# Altium schematic sheet _2__Power_Supply_Board.SchDoc
size A4; DocumentNumber: 2; SheetNumber: 2; SheetTotal: 2
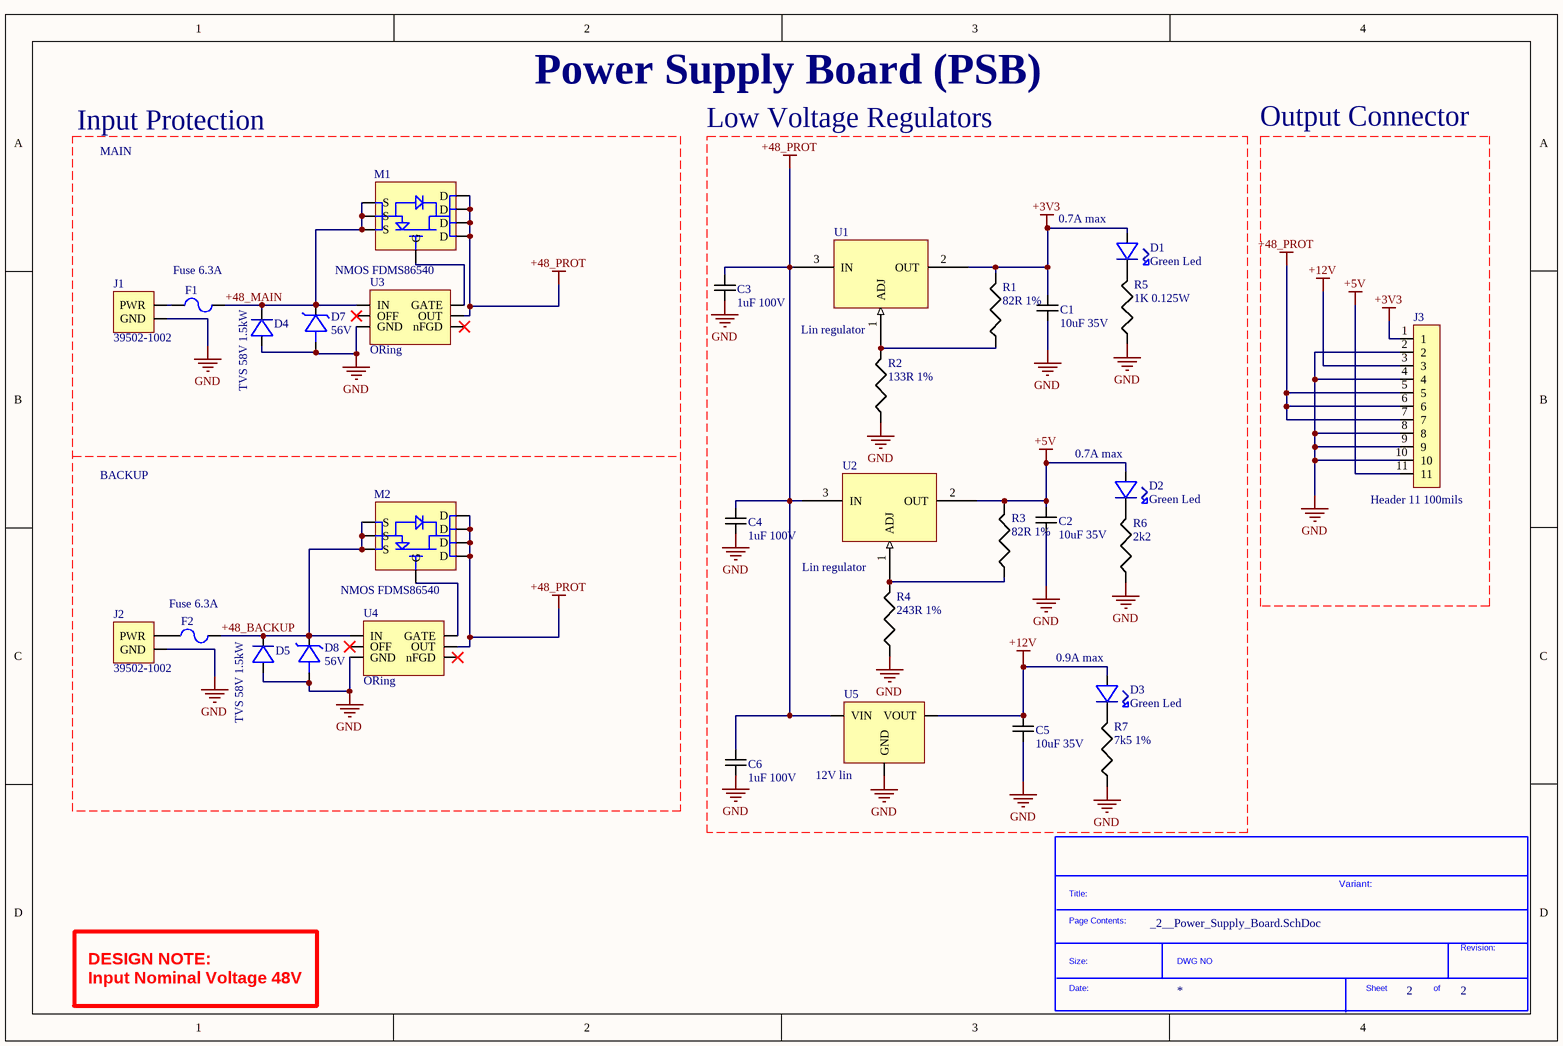
[diagram p0: _2__Power_Supply_Board.SchDoc]

## Parts
*?  SDTitleBlock  (value not drawn)  (graphical)
C1  10uF 35V  [Capacitor 1206]
C2  10uF 35V  [Capacitor 1206]
C3  1uF 100V  [C0805]
C4  1uF 100V  [C0805]
C5  10uF 35V  [Capacitor 1206]
C6  1uF 100V  [C0805]
D1  Green Led  [Led Green 0805  Dialight 5988]
D2  Green Led  [Led Green 0805  Dialight 5988]
D3  Green Led  [Led Green 0805  Dialight 5988]
D4  TVS 58V 1.5kW  [TVS SMCJSeries]
D5  TVS 58V 1.5kW  [TVS SMCJSeries]
D7  56V  [DIODE ZENER 56V 1SMA5943BT3G]
D8  56V  [DIODE ZENER 56V 1SMA5943BT3G]
F1  Fuse 6.3A  [FUSE SMD 6.3A SF-2410FP630W]
F2  Fuse 6.3A  [FUSE SMD 6.3A SF-2410FP630W]
J1  39502-1002  [Terminal Block 0395021002]
J2  39502-1002  [Terminal Block 0395021002]
J3  Header 11 100mils  [Header 11 pos Male 2.54]
M1  NMOS FDMS86540  [NMOS FDMS86540]
M2  NMOS FDMS86540  [NMOS FDMS86540]
R1  82R 1%  [Resistor R0805 Panasonic ERJ]
R2  133R 1%  [Resistor R0805 Panasonic ERJ]
R3  82R 1%  [Resistor R0805 Panasonic ERJ]
R4  243R 1%  [Resistor R0805 Panasonic ERJ]
R5  1K 0.125W  [Resistor R0805 Panasonic ERJ]
R6  2k2  [Resistor R0805 Panasonic ERJ]
R7  7k5 1%  [Resistor R0805 Panasonic ERJ]
U1  Lin regulator  [Linear TL783CKTTR]
U2  Lin regulator  [Linear TL783CKTTR]
U3  ORing  [LM5050]
U4  ORing  [LM5050]
U5  12V lin  [Linear ZXTR2012K]

## Nets
+3V3: C1.2 D1.2 J3.1 R1.2 U1.2(OUT)
+5V: C2.2 D2.2 J3.11 R3.2 U2.2(OUT)
+12V: C5.2 D3.2 J3.3 U5.3(VOUT)
+48_PROT: C3.2 C4.2 C6.2 J3.5 J3.6 J3.7 M1.5(D) M1.6(D) M1.7(D) M1.8(D) M2.5(D) M2.6(D) M2.7(D) M2.8(D) U1.3(IN) U2.3(IN) U3.6(OUT) U4.6(OUT) U5.2(VIN)
GND: C1.1 C2.1 C3.1 C4.1 C5.1 C6.1 D4.2 D5.2 D7.2 D8.2 J1.2(GND) J2.2(GND) J3.2 J3.4 J3.8 J3.9 J3.10 R2.1 R4.1 R5.1 R6.1 R7.1 U3.2(GND) U4.2(GND) U5.1(GND)
+48_BACKUP: D5.1 D8.1 F2.2 M2.1(S) M2.2(S) M2.3(S) U4.4(IN)
+48_MAIN: D4.1 D7.1 F1.2 M1.1(S) M1.2(S) M1.3(S) U3.4(IN)
NetD1_1: D1.1 R5.2
NetD2_1: D2.1 R6.2
NetD3_1: D3.1 R7.2
NetF1_1: F1.1 J1.1(PWR)
NetF2_1: F2.1 J2.1(PWR)
NetM1_4: M1.4(G) U3.5(GATE)
NetM2_4: M2.4(G) U4.5(GATE)
NetR1_1: R1.1 R2.2 U1.1(ADJ)
NetR3_1: R3.1 R4.2 U2.1(ADJ)

Not connected (* = marked no-connect by the designer): U3 1(nFGD)* 3(OFF)*; U4 1(nFGD)* 3(OFF)*

## Notes on the sheet
- Power Supply Board (PSB)
- Input Protection
- MAIN
- Low Voltage Regulators
- Output Connector
- (near D1) 0.7A max
- (near D2) 0.7A max
- BACKUP
- (near D3) 0.9A max
- Variant:
- DESIGN NOTE:
  Input Nominal Voltage 48V
- Title
- Size:
- Date:
- A4
- Number:
- Time:
- Revision:
- Sheet
- of
- File:
- (in symbol SDTitleBlock) Title:; Page Contents:; Revision:; Size:; DWG NO; Date:; Sheet; of

## Library data of the parts
C1 C2 C5 = GMK316AB7106KL-TR: CAP CER 10UF 35V X7R 1206; Manufacturer: Taiyo Yuden; Tolerance: 10%; Supplier 1: Digi-Key; Manufacturer Part Number: GMK316AB7106KL-TR; Stock 1: 2000; Pricing 1: 1=0.61, 10=0.431, 100=0.2841, 500=0.21046, 1000=0.17888 (USD); Mount: Surface Mount; Case/Package: 1206; Case Code (Imperial): 1206; Case Code (Metric): 3216; Min Operating Temperature: -55°C; Max Operating Temperature: 125°C; Capacitance: 10uF; Package Quantity: 2000; Voltage Rating: 35V; Voltage Rating (DC): 35V; Packaging: Tape and Reel; Dielectric: X7R; Termination: SMD/SMT; Composition: Ceramic; Length: 0.126inch; Height: 1.6mm; Width: 1.6mm; Thickness: 0.071inch; REACH SVHC: No SVHC; ComponentLink1URL: http://www.farnell.com/datasheets/1497285.pdf; ComponentLink1Description: http://www.farnell.com/datasheets/1497285.pdf; ComponentLink2URL: https://media.digikey.com/pdf/Data%20Sheets/Taiyo%20Yuden%20PDFs%20URL%20links/GMK316AB7106KL-TR_ProdSpec.pdf; ComponentLink2Description: https://media.digikey.com/pdf/Data%20Sheets/Taiyo%20Yuden%20PDFs%20URL%20links/GMK316AB7106KL-TR_ProdSpec.pdf; Supplier Part Number 1: 587-3007-6-ND
C3 C4 C6 = GRM21BC72A105KE01L: Cap Ceramic 1uF 100V X7S 10% Pad SMD 0805 125C T/R; Manufacturer: Murata; Supplier 1: Digi-Key; Manufacturer Part Number: GRM21BC72A105KE01L; RoHS: No; Category: Ceramic Capacitors; Stock 1: 18361; Pricing 1: 1=0,46000, 10=0,32600, 100=0,21450, 500=0,15888, 1000=0,13505 (USD); Voltage Rating (DC): 100V; Dielectric: X7S; Tolerance: 10%; Capacitance: 1uF; Length: 2mm; Width: 1.25mm; Thickness: 1.25mm; ComponentLink1URL: http://search.murata.co.jp/Ceramy/image/img/A01X/G101/ENG/GRM21BC72A105KE01-01.pdf?src-supplier=Digi-Key; ComponentLink1Description: http://search.murata.co.jp/Ceramy/image/img/A01X/G101/ENG/GRM21BC72A105KE01-01.pdf?src-supplier=Digi-Key; ComponentLink2URL: https://search.murata.co.jp/Ceramy/image/img/A01X/G101/ENG/GRM21BC72A105KE01-01.pdf?src-supplier=Digi-Key; ComponentLink2Description: https://search.murata.co.jp/Ceramy/image/img/A01X/G101/ENG/GRM21BC72A105KE01-01.pdf?src-supplier=Digi-Key; Supplier Part Number 1: 490-14464-1-ND
D1-D3 = 598-8170-107F: LED 0805 GREEN 20MCD; Manufacturer: Dialight; Lens Color: Colorless,Clear; Lens Transparency: Clear; Reverse Voltage: 5V; Lens Style: Flat,Rectangular,Clear,Diffused,Colorless; Forward Voltage: 2.4V; Viewing Angle: 140°; Wavelength: 570nm; Forward Current: 20mA; Number of LEDs: 1; Power Dissipation: 60mW; Lens Size: 1.25mm; Supplier 1: Digi-Key; Manufacturer Part Number: 598-8170-107F; RoHS: Yes; Category: LEDs; Stock 1: 101069; Pricing 1: 1=0,39000, 10=0,28200, 100=0,12520, 500=0,08766, 1000=0,07201 (USD); Mount: Surface Mount; Case/Package: 0805; Number of Pins: 2; Case Code (Imperial): 0805; Case Code (Metric): 2012; Color: Green; Min Operating Temperature: -30°C; Max Operating Temperature: 85°C; Package Quantity: 3000; Packaging: Tape and Reel; Luminous Intensity: 20mcd; Illumination Color: Green; Test Current: 20mA; Dominant Wavelength: 570nm; Number of Elements: 1; Length: 2mm; Height: 0.8mm; Width: 1.25mm; Depth: 1.25mm; Radiation Hardening: No; REACH SVHC: No SVHC; Lead Free: Lead Free; ComponentLink1URL: https://datasheet.ciiva.com/11774/0900766b80ae2984-11774107.pdf?src-supplier=RSComponents; ComponentLink1Description: https://datasheet.ciiva.com/11774/0900766b80ae2984-11774107.pdf?src-supplier=RSComponents; ComponentLink2URL: https://datasheet.ciiva.com/15117/getdatasheetpartid-104614-15117453.pdf?src-supplier=Verical; ComponentLink2Description: https://datasheet.ciiva.com/15117/getdatasheetpartid-104614-15117453.pdf?src-supplier=Verical; ComponentLink3URL: https://datasheet.ciiva.com/2110/smt-selector-guide-2110053.pdf?src-supplier=Digi-Key; ComponentLink3Description: https://datasheet.ciiva.com/2110/smt-selector-guide-2110053.pdf?src-supplier=Digi-Key; ComponentLink4URL: https://datasheet.ciiva.com/1243/25662-1243901.pdf?src-supplier=Element14; ComponentLink4Description: https://datasheet.ciiva.com/1243/25662-1243901.pdf?src-supplier=Element14; ComponentLink5URL: https://datasheet.ciiva.com/30132/mdei5980805-a-w-30132781.pdf?src-supplier=Onlinecomponents.com; ComponentLink5Description: https://datasheet.ciiva.com/30132/mdei5980805-a-w-30132781.pdf?src-supplier=Onlinecomponents.com; ComponentLink6URL: https://datasheet.ciiva.com/2110/smt-selector-guide-2110051.pdf?src-supplier=Digi-Key; ComponentLink6Description: https://datasheet.ciiva.com/2110/smt-selector-guide-2110051.pdf?src-supplier=Digi-Key; ComponentLink7URL: https://datasheet.ciiva.com/2110/smt-selector-guide-2110052.pdf?src-supplier=Digi-Key; ComponentLink7Description: https://datasheet.ciiva.com/2110/smt-selector-guide-2110052.pdf?src-supplier=Digi-Key; ComponentLink8URL: https://datasheet.ciiva.com/15965/mdei5980805-a-w-15965496.pdf?src-supplier=Onlinecomponents.com; ComponentLink8Description: https://datasheet.ciiva.com/15965/mdei5980805-a-w-15965496.pdf?src-supplier=Onlinecomponents.com; ComponentLink9URL: https://datasheet.ciiva.com/22748/1484480-22748121.pdf?src-supplier=Element14; ComponentLink9Description: https://datasheet.ciiva.com/22748/1484480-22748121.pdf?src-supplier=Element14; ComponentLink10URL: https://datasheet.ciiva.com/1243/25662-1243902.pdf?src-supplier=Element14; ComponentLink10Description: https://datasheet.ciiva.com/1243/25662-1243902.pdf?src-supplier=Element14; Supplier Part Number 1: 350-2044-1-ND
D4 D5 = SMCJ58CA: TVS DIODE 58VWM 93.6VC SMC; Manufacturer: Littelfuse; Leakage Current: 1uA; Breakdown Voltage: 64.4V; Number of Channels: 1; Clamping Voltage: 93.6V; Polarity: Bidirectional; Power Line Protection: No; Peak Pulse Current: 16.1A; Test Current: 1mA; Max Breakdown Voltage: 71.2V; Max Power Dissipation: 6.5W; Supplier 1: Digi-Key; Manufacturer Part Number: SMCJ58CA; RoHS: Yes; Category: TVS Diodes; Stock 1: 5077; Pricing 1: 1=0,61000, 10=0,52500, 25=0,49000, 100=0,36400, 250=0,34580, 500=0,28420, 1000=0,23100 (USD); Mount: Surface Mount; Number of Pins: 2; Min Operating Temperature: -65°C; Max Operating Temperature: 150°C; Voltage Rating (DC): 58V; Peak Pulse Power: 1.5kW; Termination: SMD/SMT; Number of Bidirectional Channels: 1; Direction: Bidirectional; Reverse Standoff Voltage: 58V; Min Breakdown Voltage: 64.4V; Reverse Breakdown Voltage: 64.4V; Packaging: Tape and Reel; Number of Elements: 1; Package Quantity: 3000; Operating Supply Voltage: 58V; Power Dissipation: 1.5kW; Max Surge Current: 16.1A; Composition: Zener; Length: 8.13mm; Height: 2.62mm; Width: 6.22mm; Lead Free: Lead Free; REACH SVHC: No SVHC; ComponentLink1URL: https://datasheet.ciiva.com/16388/smcj58ca-16388266.pdf?src-supplier=Future+Electronics; ComponentLink1Description: https://datasheet.ciiva.com/16388/smcj58ca-16388266.pdf?src-supplier=Future+Electronics; ComponentLink2URL: https://datasheet.ciiva.com/4509/littelfuse-tvs-diode-smcj-62645-4509016.pdf?src-supplier=Mouser; ComponentLink2Description: https://datasheet.ciiva.com/4509/littelfuse-tvs-diode-smcj-62645-4509016.pdf?src-supplier=Mouser; ComponentLink3URL: https://datasheet.ciiva.com/332/littelfuse-tvs-diode-smcj-datasheet-pdf-332399.pdf?src-supplier=Digi-Key; ComponentLink3Description: https://datasheet.ciiva.com/332/littelfuse-tvs-diode-smcj-datasheet-pdf-332399.pdf?src-supplier=Digi-Key; ComponentLink4URL: https://datasheet.ciiva.com/332/littelfuse-tvs-diode-smcj-datasheet-pdf-332397.pdf?src-supplier=Digi-Key; ComponentLink4Description: https://datasheet.ciiva.com/332/littelfuse-tvs-diode-smcj-datasheet-pdf-332397.pdf?src-supplier=Digi-Key; ComponentLink5URL: https://datasheet.ciiva.com/332/littelfuse-tvs-diode-smcj-datasheet-pdf-332398.pdf?src-supplier=Digi-Key; ComponentLink5Description: https://datasheet.ciiva.com/332/littelfuse-tvs-diode-smcj-datasheet-pdf-332398.pdf?src-supplier=Digi-Key; Supplier Part Number 1: SMCJ58CALFCT-ND
D7 D8 = 1SMA5943BT3G: Diodes Zener 56V 1.5W; Manufacturer: ON Semiconductor; Impedance: 86R; Max Reverse Leakage Current: 500nA; Voltage Tolerance: 5%; Power Dissipation: 500mW; Zener Current: 27mA; Test Current: 6.7mA; Breakdown Voltage: 58.8V; Forward Voltage: 1.5V; Element Configuration: Single; Supplier 1: Digi-Key; Manufacturer Part Number: 1SMA5943BT3G; RoHS: Yes; Category: Zener Diodes; Stock 1: 25856; Pricing 1: 1=0,43000, 10=0,32200, 25=0,29040, 100=0,15310, 250=0,15152, 500=0,13570, 1000=0,10560, 2500=0,09662 (USD); Case/Package: SMA; Number of Pins: 2; Min Operating Temperature: -65°C; Max Operating Temperature: 150°C; Packaging: Tape and Reel; Zener Voltage: 56V; Max Power Dissipation: 1.5W; Power Rating: 1.5W; Voltage Rating (DC): 56V; Tolerance: 5%; Working Voltage: 56V; Package Quantity: 1; Peak Reverse Current: 500nA; Length: 4.57mm; Height: 2.05mm; Width: 2.92mm; Radiation Hardening: No; Lead Free: Lead Free; Halogen Free: Halogen Free; REACH SVHC: No SVHC; ComponentLink1URL: https://datasheet.ciiva.com/15142/getdatasheetpartid-53895-15142138.pdf?src-supplier=Verical; ComponentLink1Description: https://datasheet.ciiva.com/15142/getdatasheetpartid-53895-15142138.pdf?src-supplier=Verical; ComponentLink2URL: https://datasheet.ciiva.com/4733/1sma5913bt3-d-4733669.pdf?src-supplier=Mouser; ComponentLink2Description: https://datasheet.ciiva.com/4733/1sma5913bt3-d-4733669.pdf?src-supplier=Mouser; ComponentLink3URL: https://datasheet.ciiva.com/16311/1sma5913bt3-d-16311897.pdf?src-supplier=Future+Electronics; ComponentLink3Description: https://datasheet.ciiva.com/16311/1sma5913bt3-d-16311897.pdf?src-supplier=Future+Electronics; ComponentLink4URL: https://datasheet.ciiva.com/6388/1sma5913bt3-d-6388892.pdf?src-supplier=Digi-Key; ComponentLink4Description: https://datasheet.ciiva.com/6388/1sma5913bt3-d-6388892.pdf?src-supplier=Digi-Key; ComponentLink5URL: https://datasheet.ciiva.com/6388/1sma5913bt3-d-6388890.pdf?src-supplier=Digi-Key; ComponentLink5Description: https://datasheet.ciiva.com/6388/1sma5913bt3-d-6388890.pdf?src-supplier=Digi-Key; ComponentLink6URL: https://datasheet.ciiva.com/6388/1sma5913bt3-d-6388891.pdf?src-supplier=Digi-Key; ComponentLink6Description: https://datasheet.ciiva.com/6388/1sma5913bt3-d-6388891.pdf?src-supplier=Digi-Key; Supplier Part Number 1: 1SMA5943BT3GOSCT-ND
F1 F2 = SF-2410FP630W-2: Fuse 2410 SMD FAST-ACTING PRECISION W; Manufacturer: Bourns; Fuse Type: Board Mount (Cartridge Style Excluded); Voltage Rating (AC): 125V; DC Cold Resistance: 10mR; Approvals: UL; Supplier 1: Digi-Key; Manufacturer Part Number: SF-2410FP630W-2; RoHS: No; Stock 1: 1970; Pricing 1: 1=1,16000, 5=1,12600, 10=1,05300, 50=0,87120, 100=0,72600, 250=0,70784, 500=0,59896, 1000=0,52635 (USD); Mount: Surface Mount; Case/Package: 2410; Case Code (Imperial): 2410; Case Code (Metric): 6125; Min Operating Temperature: -55°C; Max Operating Temperature: 125°C; Packaging: Tape and Reel; Current Rating: 6.3A; Voltage Rating (DC): 125V; ComponentLink1URL: https://www.bourns.com/docs/Product-Datasheets/SF-2410FPxxxW.pdf?src-supplier=Digi-Key; ComponentLink1Description: https://www.bourns.com/docs/Product-Datasheets/SF-2410FPxxxW.pdf?src-supplier=Digi-Key; Supplier Part Number 1: SF-2410FP630W-2CT-ND
J1 J2 = 39502-1002: Terminal Block,2 Contacts,PIN ;RoHS Compliant: Yes; Manufacturer: Molex; Number of Positions: 2; Contact Resistance: 8mR; Current Rating: 8A; Voltage Rating: 300V; Pitch: 3.5mm; Supplier 1: Digi-Key; Manufacturer Part Number: 39502-1002; RoHS: Yes; Category: Headers and Wire Housings; Stock 1: 12700; Pricing 1: 1=0,58000, 10=0,54000, 100=0,41400, 500=0,36000, 1000=0,29700, 5000=0,26100, 10000=0,24300 (USD); Mount: Through Hole; Color: Black; Contact Plating: Tin; Housing Material: Nylon; Contact Material: Brass; Housing Color: Black; Min Operating Temperature: -40°C; Max Operating Temperature: 105°C; Termination: Through Hole; Number of Rows: 1; Orientation: Horizontal; Number of Contacts: 2; Package Quantity: 1800; Number of Circuits: 2; Length: 8.4mm; Width: 9.2mm; Flammability Rating: UL94 V-0; REACH SVHC: No SVHC; ELV: Compliant; Halogen Free: Low Halogen; Lead Free: Lead Free; ComponentLink1URL: https://datasheet.ciiva.com/5192/0395021002-terminal-blocks-163773-5192965.pdf?src-supplier=Mouser; ComponentLink1Description: https://datasheet.ciiva.com/5192/0395021002-terminal-blocks-163773-5192965.pdf?src-supplier=Mouser; Supplier Part Number 1: WM7770-ND
J3 = PREC011SAAN-RC: HEADER 11 pins Male 2.54MM; Manufacturer: Sullins; Number of Positions: 11; Connector Type: Male Pin; Pitch: 0.1inch; Supplier 1: Digi-Key; Manufacturer Part Number: PREC011SAAN-RC; RoHS: Yes; Category: Connectors; Stock 1: 2584; Pricing 1: 1=0,26000, 10=0,24500, 25=0,20920, 50=0,18300, 100=0,16990, 250=0,15028, 500=0,14374 (USD); Mount: Through Hole; Contact Plating: Tin; Color: Black; Package Quantity: 1; Number of Rows: 1; Packaging: Bulk; Termination: Solder; Contact Mating Length: 0.23inch; ComponentLink1URL: https://datasheet.ciiva.com/740/zrzczzzszzn-rc-st-11635-b-740834.pdf?src-supplier=Digi-Key; ComponentLink1Description: https://datasheet.ciiva.com/740/zrzczzzszzn-rc-st-11635-b-740834.pdf?src-supplier=Digi-Key; Supplier Part Number 1: S1012EC-11-ND
M1 M2 = FDMS86540: MOSFET 60V N-Channel PowerTrench MOSFET; Manufacturer: ON Semiconductor / Fairchild; Continuous Drain Current (ID): 20A; Drain to Source Resistance: 3.4mR; Power Dissipation: 2.5W; Gate to Source Voltage (Vgs): 20V; Input Capacitance: 6.435nF; Rise Time: 16ns; Fall Time: 7.2ns; Turn-Off Delay Time: 32ns; Turn-On Delay Time: 28ns; Number of Elements: 1; Element Configuration: Single; Supplier 1: Digi-Key; Manufacturer Part Number: FDMS86540; RoHS: Yes; Category: MOSFETs; Stock 1: 1340; Pricing 1: 1=1,48000, 10=1,33200, 25=1,25640, 100=0,98010, 250=0,95496, 500=0,82930, 1000=0,70364 (USD); Mount: Surface Mount; Number of Pins: 8; Weight: 0.0681g; Min Operating Temperature: -55°C; Max Operating Temperature: 150°C; Packaging: Tape and Reel; Package Quantity: 3000; Rds On Max: 3.4mR; Drain to Source Voltage (Vdss): 60V; Max Power Dissipation: 2.5W; Drain to Source Breakdown Voltage: 60V; Length: 5mm; Height: 1.05mm; Width: 5.75mm; Radiation Hardening: No; ComponentLink1URL: https://datasheet.ciiva.com/6374/fdms86540-6374392.pdf?src-supplier=Digi-Key; ComponentLink1Description: https://datasheet.ciiva.com/6374/fdms86540-6374392.pdf?src-supplier=Digi-Key; ComponentLink2URL: https://datasheet.ciiva.com/15044/fdms86540-15044107.pdf?src-supplier=Digi-Key; ComponentLink2Description: https://datasheet.ciiva.com/15044/fdms86540-15044107.pdf?src-supplier=Digi-Key; ComponentLink3URL: https://datasheet.ciiva.com/11176/fdms86540-11176218.pdf?src-supplier=Avnet; ComponentLink3Description: https://datasheet.ciiva.com/11176/fdms86540-11176218.pdf?src-supplier=Avnet; ComponentLink4URL: https://datasheet.ciiva.com/15044/fdms86540-15044106.pdf?src-supplier=Digi-Key; ComponentLink4Description: https://datasheet.ciiva.com/15044/fdms86540-15044106.pdf?src-supplier=Digi-Key; ComponentLink5URL: https://datasheet.ciiva.com/15044/fdms86540-15044108.pdf?src-supplier=Digi-Key; ComponentLink5Description: https://datasheet.ciiva.com/15044/fdms86540-15044108.pdf?src-supplier=Digi-Key; Supplier Part Number 1: FDMS86540CT-ND
R1 R3 = ERJ6ENF82R0V: Res Thick Film 0805  82R, 150 V, Thick Film, 125 mW; Manufacturer: Panasonic; Temperature Coefficient: 100ppm/°C; Voltage Rating (DC): 150V; Power Rating: 125mW; Supplier 1: Digi-Key; Manufacturer Part Number: ERJ6ENF82R0V; RoHS: Yes; Category: Chip SMD Resistors; Stock 1: 574630; Pricing 1: 1=0,10000, 10=0,07300, 100=0,02820, 1000=0,01239, 2500=0,01070 (USD); Mount: Surface Mount; Case/Package: 0805; Number of Pins: 2; Weight: 0.000194oz; Case Code (Imperial): 0805; Case Code (Metric): 2012; Contact Plating: Tin; Min Operating Temperature: -55°C; Max Operating Temperature: 155°C; Composition: Thick Film; Termination: SMD/SMT; Number of Terminations: 2; Military Standard: Not; Resistance: 82R; Tolerance: 1%; Voltage Rating: 150V; Packaging: Tape and Reel; Package Quantity: 5000; Max Power Dissipation: 125mW; Length: 2mm; Height: 0.6mm; Depth: 1.25mm; Width: 1.2mm; Radiation Hardening: No; REACH SVHC: No SVHC; ComponentLink1URL: https://datasheet.ciiva.com/11821/0900766b80f80784-11821707.pdf?src-supplier=RSComponents; ComponentLink1Description: https://datasheet.ciiva.com/11821/0900766b80f80784-11821707.pdf?src-supplier=RSComponents; ComponentLink2URL: https://datasheet.ciiva.com/22674/1678782-22674437.pdf?src-supplier=Element14; ComponentLink2Description: https://datasheet.ciiva.com/22674/1678782-22674437.pdf?src-supplier=Element14; ComponentLink3URL: https://datasheet.ciiva.com/7909/426256-7909238.pdf?src-supplier=Element14; ComponentLink3Description: https://datasheet.ciiva.com/7909/426256-7909238.pdf?src-supplier=Element14; ComponentLink4URL: https://datasheet.ciiva.com/22699/1678782-22699126.pdf?src-supplier=Element14; ComponentLink4Description: https://datasheet.ciiva.com/22699/1678782-22699126.pdf?src-supplier=Element14; ComponentLink5URL: https://datasheet.ciiva.com/46444/1678782-46444824.pdf?src-supplier=Element14; ComponentLink5Description: https://datasheet.ciiva.com/46444/1678782-46444824.pdf?src-supplier=Element14; ComponentLink6URL: https://datasheet.ciiva.com/17208/aoa0000ce2-17208445.pdf?src-supplier=Avnet+Europe; ComponentLink6Description: https://datasheet.ciiva.com/17208/aoa0000ce2-17208445.pdf?src-supplier=Avnet+Europe; ComponentLink7URL: https://datasheet.ciiva.com/6137/426256-6137583.pdf?src-supplier=Farnell; ComponentLink7Description: https://datasheet.ciiva.com/6137/426256-6137583.pdf?src-supplier=Farnell; ComponentLink8URL: https://datasheet.ciiva.com/7909/426256-7909557.pdf?src-supplier=Element14; ComponentLink8Description: https://datasheet.ciiva.com/7909/426256-7909557.pdf?src-supplier=Element14; ComponentLink9URL: https://datasheet.ciiva.com/9187/aoa0000ce2-9187509.pdf?src-supplier=Avnet; ComponentLink9Description: https://datasheet.ciiva.com/9187/aoa0000ce2-9187509.pdf?src-supplier=Avnet; Supplier Part Number 1: P82.0CCT-ND
R2 = ERJ-6ENF1330V: Res Thick Film 0805 133R, 125 mW,  1%, 150 V; Manufacturer: Panasonic; Voltage Rating (DC): 150V; Max Power Dissipation: 125mW; Temperature Coefficient: 100ppm/°C; Supplier 1: Digi-Key; Manufacturer Part Number: ERJ-6ENF1330V; RoHS: Yes; Category: Chip SMD Resistors; Stock 1: 42590; Pricing 1: 1=0,10000, 10=0,07200, 100=0,02750, 1000=0,01210, 2500=0,01045 (USD); Mount: Surface Mount; Case/Package: 0805; Contact Plating: Tin; Case Code (Metric): 2012; Case Code (Imperial): 0805; Min Operating Temperature: -55°C; Max Operating Temperature: 155°C; Features: Automotive AEC-Q200; Composition: Thick Film; Number of Terminations: 2; Military Standard: Not; Resistance: 133R; Power Rating: 125mW; Tolerance: 1%; Packaging: Tape and Reel; Package Quantity: 1; Voltage Rating: 150V; Length: 2mm; Height: 0.028inch; Depth: 1.25mm; Height - Seated (Max): 0.028inch; Width: 0.049inch; Lead Free: Lead Free; REACH SVHC: No SVHC; ComponentLink1URL: https://datasheet.ciiva.com/24030/aoa0000ce2-24030873.pdf?src-supplier=Mouser; ComponentLink1Description: https://datasheet.ciiva.com/24030/aoa0000ce2-24030873.pdf?src-supplier=Mouser; ComponentLink2URL: https://datasheet.ciiva.com/22674/1678782-22674122.pdf?src-supplier=Element14; ComponentLink2Description: https://datasheet.ciiva.com/22674/1678782-22674122.pdf?src-supplier=Element14; ComponentLink3URL: https://datasheet.ciiva.com/22722/1678782-22722111.pdf?src-supplier=Farnell; ComponentLink3Description: https://datasheet.ciiva.com/22722/1678782-22722111.pdf?src-supplier=Farnell; ComponentLink4URL: https://datasheet.ciiva.com/30209/aoa0000ce2-30209679.pdf?src-supplier=Onlinecomponents.com; ComponentLink4Description: https://datasheet.ciiva.com/30209/aoa0000ce2-30209679.pdf?src-supplier=Onlinecomponents.com; ComponentLink5URL: https://datasheet.ciiva.com/46444/1678782-46444031.pdf?src-supplier=Element14; ComponentLink5Description: https://datasheet.ciiva.com/46444/1678782-46444031.pdf?src-supplier=Element14; ComponentLink6URL: https://datasheet.ciiva.com/22739/1678782-22739625.pdf?src-supplier=Element14; ComponentLink6Description: https://datasheet.ciiva.com/22739/1678782-22739625.pdf?src-supplier=Element14; Supplier Part Number 1: P133CCT-ND
R4 = ERJ-6ENF2430V: Res Thick Film 0805 243 R, 125 mW,  1%, 150 V; Manufacturer: Panasonic; Max Power Dissipation: 125mW; Voltage Rating: 150V; Temperature Coefficient: 100ppm/°C; Supplier 1: Digi-Key; Manufacturer Part Number: ERJ-6ENF2430V; RoHS: Yes; Category: Chip SMD Resistors; Stock 1: 45725; Pricing 1: 1=0,10000, 10=0,07200, 100=0,02750, 1000=0,01210, 2500=0,01045 (USD); Mount: Surface Mount; Case/Package: 0805; Contact Plating: Tin; Case Code (Metric): 2012; Case Code (Imperial): 0805; Min Operating Temperature: -55°C; Max Operating Temperature: 155°C; Packaging: Tape and Reel; Resistance: 243R; Power Rating: 125mW; Tolerance: 1%; Package Quantity: 1; Voltage Rating (DC): 150V; Composition: Thick Film; Number of Terminations: 2; Military Standard: Not; Features: Automotive AEC-Q200; Termination: SMD/SMT; Length: 2mm; Height: 0.028inch; Width: 0.049inch; Depth: 1.25mm; Radiation Hardening: No; Lead Free: Lead Free; REACH SVHC: Unknown; ComponentLink1URL: https://datasheet.ciiva.com/9183/aoa0000ce2-9183885.pdf?src-supplier=Avnet; ComponentLink1Description: https://datasheet.ciiva.com/9183/aoa0000ce2-9183885.pdf?src-supplier=Avnet; ComponentLink2URL: https://datasheet.ciiva.com/28685/1678782-28685368.pdf?src-supplier=Element14; ComponentLink2Description: https://datasheet.ciiva.com/28685/1678782-28685368.pdf?src-supplier=Element14; ComponentLink3URL: https://datasheet.ciiva.com/15159/getdatasheetpartid-249650-15159067.pdf?src-supplier=Verical; ComponentLink3Description: https://datasheet.ciiva.com/15159/getdatasheetpartid-249650-15159067.pdf?src-supplier=Verical; ComponentLink4URL: https://datasheet.ciiva.com/30251/aoa0000ce2-30251515.pdf?src-supplier=Onlinecomponents.com; ComponentLink4Description: https://datasheet.ciiva.com/30251/aoa0000ce2-30251515.pdf?src-supplier=Onlinecomponents.com; ComponentLink5URL: https://datasheet.ciiva.com/24026/aoa0000ce2-24026236.pdf?src-supplier=Mouser; ComponentLink5Description: https://datasheet.ciiva.com/24026/aoa0000ce2-24026236.pdf?src-supplier=Mouser; ComponentLink6URL: https://datasheet.ciiva.com/46377/426256-46377788.pdf?src-supplier=Element14; ComponentLink6Description: https://datasheet.ciiva.com/46377/426256-46377788.pdf?src-supplier=Element14; ComponentLink7URL: https://datasheet.ciiva.com/16764/70260748-16764175.pdf?src-supplier=Allied+Electronics; ComponentLink7Description: https://datasheet.ciiva.com/16764/70260748-16764175.pdf?src-supplier=Allied+Electronics; ComponentLink8URL: https://datasheet.ciiva.com/46389/426256-46389327.pdf?src-supplier=Element14; ComponentLink8Description: https://datasheet.ciiva.com/46389/426256-46389327.pdf?src-supplier=Element14; Supplier Part Number 1: P243CCT-ND
R5 = ERJ6ENF1001V: Res 0805, 1K, 0.125W; Manufacturer: Panasonic; Resistance: 1kR; Power Rating: 125mW; Tolerance: 1%; Temperature Coefficient: 100ppm/°C; Voltage Rating (DC): 150V; Supplier 1: Digi-Key; Manufacturer Part Number: ERJ6ENF1001V; Stock 1: 946321; Pricing 1: 1=0.1, 10=0.081, 100=0.0311, 1000=0.01367, 2500=0.01181 (USD); Mount: Surface Mount; Case/Package: 0805; Number of Pins: 2; Case Code (Metric): 2012; Case Code (Imperial): 0805; Contact Plating: Tin; Min Operating Temperature: -55°C; Max Operating Temperature: 155°C; Packaging: Tape and Reel; Number of Terminations: 2; Package Quantity: 1; Voltage Rating: 150V; Composition: Thick Film; Termination: SMD/SMT; Military Standard: Not; Max Power Dissipation: 125mW; Features: Automotive AEC-Q200; Length: 2mm; Height: 0.6mm; Width: 0.049inch; Depth: 1.25mm; Radiation Hardening: No; REACH SVHC: No SVHC; Lead Free: Lead Free; ComponentLink1URL: http://www.jameco.com/Jameco/Products/ProdDS/1988962.pdf?src-supplier=Jameco; ComponentLink1Description: http://www.jameco.com/Jameco/Products/ProdDS/1988962.pdf?src-supplier=Jameco; ComponentLink2URL: http://www.farnell.com/datasheets/426256.pdf?src-supplier=Element14; ComponentLink2Description: http://www.farnell.com/datasheets/426256.pdf?src-supplier=Element14; ComponentLink3URL: http://www.alliedelec.com/m/d/623f45ff1957d936ff56d46fd1c28cac.pdf?src-supplier=Allied+Electronics; ComponentLink3Description: http://www.alliedelec.com/m/d/623f45ff1957d936ff56d46fd1c28cac.pdf?src-supplier=Allied+Electronics; ComponentLink4URL: http://www.farnell.com/datasheets/1678782.pdf?src-supplier=Element14; ComponentLink4Description: http://www.farnell.com/datasheets/1678782.pdf?src-supplier=Element14; ComponentLink5URL: http://industrial.panasonic.com/www-data/pdf/AOA0000/AOA0000CE2.pdf?src-supplier=Avnet; ComponentLink5Description: http://industrial.panasonic.com/www-data/pdf/AOA0000/AOA0000CE2.pdf?src-supplier=Avnet; ComponentLink6URL: http://industrial.panasonic.com/www-data/pdf/AOA0000/AOA0000CE2.pdf?src-supplier=Future+Electronics; ComponentLink6Description: http://industrial.panasonic.com/www-data/pdf/AOA0000/AOA0000CE2.pdf?src-supplier=Future+Electronics; ComponentLink7URL: http://industrial.panasonic.com/www-data/pdf/AOA0000/AOA0000CE2.pdf?src-supplier=Avnet+Asia; ComponentLink7Description: http://industrial.panasonic.com/www-data/pdf/AOA0000/AOA0000CE2.pdf?src-supplier=Avnet+Asia; Supplier Part Number 1: P1.00KCDKR-ND
R6 = ERJ6ENF2201V: Res Thick Film 00805 2.2K 1% 1/8W 0805; Manufacturer: Panasonic; Resistance: 2.2kR; Power Rating: 125mW; Voltage Rating: 150V; Temperature Coefficient: 100ppm/°C; Supplier 1: Digi-Key; Manufacturer Part Number: ERJ6ENF2201V; Stock 1: 189076; Pricing 1: 1 = 0,10000, 10 = 0,08700, 100 = 0,03330, 1000 = 0,01464, 2500 = 0,01264 (USD); RoHS: Yes; Mount: Surface Mount; Case/Package: 0805; Number of Pins: 2; Weight: 0.000194oz; Case Code (Metric): 2012; Case Code (Imperial): 0805; Contact Plating: Tin; Min Operating Temperature: -55°C; Max Operating Temperature: 155°C; Tolerance: 1%; Packaging: Tape and Reel; Package Quantity: 1; Composition: Thick Film; Number of Terminations: 2; Termination: SMD/SMT; Military Standard: Not; Max Power Dissipation: 125mW; Voltage Rating (DC): 150V; Features: Automotive AEC-Q200; Length: 2mm; Height: 0.6mm; Width: 0.049inch; Depth: 1.25mm; Radiation Hardening: No; REACH SVHC: No SVHC; Lead Free: Lead Free; ComponentLink1URL: https://datasheet.ciiva.com/16437/aoa0000ce2-16437797.pdf?src-supplier=Future+Electronics; ComponentLink1Description: https://datasheet.ciiva.com/16437/aoa0000ce2-16437797.pdf?src-supplier=Future+Electronics; ComponentLink2URL: https://datasheet.ciiva.com/46372/1678782-46372710.pdf?src-supplier=Element14; ComponentLink2Description: https://datasheet.ciiva.com/46372/1678782-46372710.pdf?src-supplier=Element14; ComponentLink3URL: https://datasheet.ciiva.com/24165/aoa0000ce2-24165591.pdf?src-supplier=Mouser; ComponentLink3Description: https://datasheet.ciiva.com/24165/aoa0000ce2-24165591.pdf?src-supplier=Mouser; ComponentLink4URL: https://datasheet.ciiva.com/46372/1678782-46372711.pdf?src-supplier=Element14; ComponentLink4Description: https://datasheet.ciiva.com/46372/1678782-46372711.pdf?src-supplier=Element14; ComponentLink5URL: https://datasheet.ciiva.com/22687/1678782-22687450.pdf?src-supplier=Element14; ComponentLink5Description: https://datasheet.ciiva.com/22687/1678782-22687450.pdf?src-supplier=Element14; ComponentLink6URL: https://datasheet.ciiva.com/7830/426256-7830748.pdf?src-supplier=Element14; ComponentLink6Description: https://datasheet.ciiva.com/7830/426256-7830748.pdf?src-supplier=Element14; ComponentLink7URL: https://datasheet.ciiva.com/22667/1678782-22667900.pdf?src-supplier=Element14; ComponentLink7Description: https://datasheet.ciiva.com/22667/1678782-22667900.pdf?src-supplier=Element14; ComponentLink8URL: https://datasheet.ciiva.com/7830/426256-7830990.pdf?src-supplier=Element14; ComponentLink8Description: https://datasheet.ciiva.com/7830/426256-7830990.pdf?src-supplier=Element14; Supplier Part Number 1: P2.20KCCT-ND
R7 = ERJ-6ENF7501V: Res Thick Film 7.5k 125mW, ±1%;; Manufacturer: Panasonic; Resistance: 7.5kR; Voltage Rating: 150V; Temperature Coefficient: 100ppm/°C; Supplier 1: Digi-Key; Manufacturer Part Number: ERJ-6ENF7501V; RoHS: Yes; Category: Chip SMD Resistors; Stock 1: 1517; Pricing 1: 1=0,10000, 10=0,07200, 100=0,02750, 1000=0,01210, 2500=0,01045 (USD); Mount: Surface Mount; Case/Package: 0805; Contact Plating: Tin; Case Code (Metric): 2012; Case Code (Imperial): 0805; Min Operating Temperature: -55°C; Max Operating Temperature: 155°C; Power Rating: 125mW; Tolerance: 1%; Packaging: Tape and Reel; Package Quantity: 1; Features: Automotive AEC-Q200; Max Power Dissipation: 125mW; Composition: Thick Film; Number of Terminations: 2; Termination: SMD/SMT; Military Standard: Not; Voltage Rating (DC): 150V; Length: 2mm; Height: 0.6mm; Width: 0.049inch; Depth: 1.25mm; Radiation Hardening: No; REACH SVHC: Unknown; Lead Free: Lead Free; ComponentLink1URL: https://datasheet.ciiva.com/11821/0900766b80f80784-11821713.pdf?src-supplier=RSComponents; ComponentLink1Description: https://datasheet.ciiva.com/11821/0900766b80f80784-11821713.pdf?src-supplier=RSComponents; ComponentLink2URL: https://datasheet.ciiva.com/34303/1989527-34303643.pdf?src-supplier=Jameco; ComponentLink2Description: https://datasheet.ciiva.com/34303/1989527-34303643.pdf?src-supplier=Jameco; ComponentLink3URL: https://datasheet.ciiva.com/16780/70260748-16780490.pdf?src-supplier=Allied+Electronics; ComponentLink3Description: https://datasheet.ciiva.com/16780/70260748-16780490.pdf?src-supplier=Allied+Electronics; ComponentLink4URL: https://datasheet.ciiva.com/17212/aoa0000ce2-17212477.pdf?src-supplier=Avnet+Europe; ComponentLink4Description: https://datasheet.ciiva.com/17212/aoa0000ce2-17212477.pdf?src-supplier=Avnet+Europe; ComponentLink5URL: https://datasheet.ciiva.com/30143/aoa0000ce2-30143461.pdf?src-supplier=Onlinecomponents.com; ComponentLink5Description: https://datasheet.ciiva.com/30143/aoa0000ce2-30143461.pdf?src-supplier=Onlinecomponents.com; ComponentLink6URL: https://datasheet.ciiva.com/16782/70260748-16782856.pdf?src-supplier=Allied+Electronics; ComponentLink6Description: https://datasheet.ciiva.com/16782/70260748-16782856.pdf?src-supplier=Allied+Electronics; ComponentLink7URL: https://datasheet.ciiva.com/9194/aoa0000ce2-9194794.pdf?src-supplier=Avnet; ComponentLink7Description: https://datasheet.ciiva.com/9194/aoa0000ce2-9194794.pdf?src-supplier=Avnet; ComponentLink8URL: https://datasheet.ciiva.com/46373/426256-46373996.pdf?src-supplier=Element14; ComponentLink8Description: https://datasheet.ciiva.com/46373/426256-46373996.pdf?src-supplier=Element14; ComponentLink9URL: https://datasheet.ciiva.com/28675/1678782-28675837.pdf?src-supplier=Element14; ComponentLink9Description: https://datasheet.ciiva.com/28675/1678782-28675837.pdf?src-supplier=Element14; ComponentLink10URL: https://datasheet.ciiva.com/5868/426256-5868191.pdf?src-supplier=Farnell; ComponentLink10Description: https://datasheet.ciiva.com/5868/426256-5868191.pdf?src-supplier=Farnell; Supplier Part Number 1: P7.50KCCT-ND
U1 U2 = TL783CKTTR: Linear Regulator, Adjustable, 20V primary input, 1.25V to 125V/700 mA/1 Output, TO-263-3; Manufacturer: Texas Instruments; Quiescent Current: 15mA; Dropout Voltage: 10V; Polarity: Positive; Number of Regulators: 1; Min Current Limit: 700mA; Max Output Voltage: 125V; Reference Voltage: 1.3V; Min Input Voltage: 21.5V; Max Input Voltage: 150V; Power Supply Rejection Ratio (PSRR): 76dB; Supplier 1: Digi-Key; Manufacturer Part Number: TL783CKTTR; RoHS: Yes; Category: Voltage Regulators - Linear; Stock 1: 15730; Pricing 1: 1=2,39000, 10=2,14700, 25=2,02520, 100=1,62000, 250=1,41752 (USD); Mount: Surface Mount; Case/Package: TO-263; Number of Pins: 3; Weight: 0.050897oz; Min Operating Temperature: 0°C; Max Operating Temperature: 125°C; Output Type: Adjustable; Min Output Voltage: 1.25V; Number of Outputs: 1; Output Voltage: 125V; Packaging: Tape and Reel; Output Current: 700mA; Package Quantity: 1; Max Output Current: 700mA; Length: 10.18mm; Height: 4.44mm; Width: 8.41mm; Radiation Hardening: No; Lead Free: Lead Free; REACH SVHC: No SVHC; ComponentLink1URL: https://datasheet.ciiva.com/26904/tl783ckttr-26904070.pdf?src-supplier=IIIC; ComponentLink1Description: https://datasheet.ciiva.com/26904/tl783ckttr-26904070.pdf?src-supplier=IIIC; ComponentLink2URL: https://datasheet.ciiva.com/41462/001014601-da-01-en-ic-reg-ldo-adj-0-tl783ckttr-to-263-3-tid-41462450.pdf?src-supplier=Conrad; ComponentLink2Description: https://datasheet.ciiva.com/41462/001014601-da-01-en-ic-reg-ldo-adj-0-tl783ckttr-to-263-3-tid-41462450.pdf?src-supplier=Conrad; ComponentLink3URL: https://datasheet.ciiva.com/2045/tl783-2045197.pdf?src-supplier=Digi-Key; ComponentLink3Description: https://datasheet.ciiva.com/2045/tl783-2045197.pdf?src-supplier=Digi-Key; ComponentLink4URL: https://datasheet.ciiva.com/2045/tl783-2045199.pdf?src-supplier=Digi-Key; ComponentLink4Description: https://datasheet.ciiva.com/2045/tl783-2045199.pdf?src-supplier=Digi-Key; ComponentLink5URL: https://datasheet.ciiva.com/3224/tl783-3224203.pdf?src-supplier=Avnet; ComponentLink5Description: https://datasheet.ciiva.com/3224/tl783-3224203.pdf?src-supplier=Avnet; ComponentLink6URL: https://datasheet.ciiva.com/2045/tl783-2045198.pdf?src-supplier=Digi-Key; ComponentLink6Description: https://datasheet.ciiva.com/2045/tl783-2045198.pdf?src-supplier=Digi-Key; Supplier Part Number 1: 296-20778-1-ND
U3 U4 = LM5050MK-2/NOPB: IC OR CTRLR N+1 6SOT; Manufacturer: TI National Semiconductor; Quiescent Current: 400uA; Max Supply Voltage: 75V; Min Supply Voltage: 6V; Number of Outputs: 1; Operating Supply Current: 355uA; Max Output Voltage: 12V; Supplier 1: Digi-Key; Manufacturer Part Number: LM5050MK-2/NOPB; RoHS: Yes; Category: Uncategorized; Stock 1: 29342; Pricing 1: 1=2,21000, 10=1,98200, 25=1,87000, 100=1,49600, 250=1,30900, 500=1,27160 (USD); Mount: Surface Mount; Case/Package: SOT-23-6; Number of Pins: 6; Weight: 0.00127oz; Contact Plating: Tin; Min Operating Temperature: -40°C; Max Operating Temperature: 125°C; Packaging: Tape and Reel; Length: 3.05mm; Height: 1mm; Width: 1.75mm; Radiation Hardening: No; Lead Free: Lead Free; REACH SVHC: No SVHC; ComponentLink1URL: https://datasheet.ciiva.com/28632/1787943-28632260.pdf?src-supplier=Element14; ComponentLink1Description: https://datasheet.ciiva.com/28632/1787943-28632260.pdf?src-supplier=Element14; ComponentLink2URL: https://datasheet.ciiva.com/6609/lm5050-2-6609558.pdf?src-supplier=Digi-Key; ComponentLink2Description: https://datasheet.ciiva.com/6609/lm5050-2-6609558.pdf?src-supplier=Digi-Key; ComponentLink3URL: https://datasheet.ciiva.com/12085/lm5050-2-52065-12085161.pdf?src-supplier=Mouser; ComponentLink3Description: https://datasheet.ciiva.com/12085/lm5050-2-52065-12085161.pdf?src-supplier=Mouser; ComponentLink4URL: https://datasheet.ciiva.com/15110/getdatasheetpartid-494613-15110415.pdf?src-supplier=Verical; ComponentLink4Description: https://datasheet.ciiva.com/15110/getdatasheetpartid-494613-15110415.pdf?src-supplier=Verical; ComponentLink5URL: https://datasheet.ciiva.com/6609/lm5050-2-6609559.pdf?src-supplier=Digi-Key; ComponentLink5Description: https://datasheet.ciiva.com/6609/lm5050-2-6609559.pdf?src-supplier=Digi-Key; ComponentLink6URL: https://datasheet.ciiva.com/6609/lm5050-2-6609561.pdf?src-supplier=Digi-Key; ComponentLink6Description: https://datasheet.ciiva.com/6609/lm5050-2-6609561.pdf?src-supplier=Digi-Key; Supplier Part Number 1: LM5050MK-2/NOPBCT-ND
U5 = ZXTR2012K-13: LINEAR 12V 60MA TO252-3; Manufacturer: Diodes; Accuracy: 10%; Output Type: Fixed; Number of Outputs: 1; Min Input Voltage: 15V; Max Input Voltage: 100V; Max Power Dissipation: 2.3W; Polarity: Positive; Quiescent Current: 900uA; Supplier 1: Digi-Key; Manufacturer Part Number: ZXTR2012K-13; RoHS: Yes; Category: Voltage Regulators - Linear; Stock 1: 1248; Pricing 1: 1=0,64000, 10=0,54500, 25=0,50920, 100=0,37810, 250=0,31996, 500=0,30542, 1000=0,22543 (USD); Mount: Surface Mount; Case/Package: TO-252-3; Number of Pins: 3; Min Operating Temperature: -40°C; Max Operating Temperature: 125°C; Packaging: Tape and Reel; Max Output Current: 60mA; Output Voltage: 12V; Package Quantity: 2500; Output Current: 60mA; Number of Regulators: 1; Power Rating: 2.3W; Length: 6.7mm; Height: 2.26mm; Width: 6.2mm; Radiation Hardening: No; ComponentLink1URL: https://datasheet.ciiva.com/30009/zxtr2012k-30009732.pdf?src-supplier=Avnet; ComponentLink1Description: https://datasheet.ciiva.com/30009/zxtr2012k-30009732.pdf?src-supplier=Avnet; ComponentLink2URL: https://datasheet.ciiva.com/29568/zxtr2012k-29568982.pdf?src-supplier=Digi-Key; ComponentLink2Description: https://datasheet.ciiva.com/29568/zxtr2012k-29568982.pdf?src-supplier=Digi-Key; ComponentLink3URL: https://datasheet.ciiva.com/29568/zxtr2012k-29568983.pdf?src-supplier=Digi-Key; ComponentLink3Description: https://datasheet.ciiva.com/29568/zxtr2012k-29568983.pdf?src-supplier=Digi-Key; ComponentLink4URL: https://datasheet.ciiva.com/29568/zxtr2012k-29568981.pdf?src-supplier=Digi-Key; ComponentLink4Description: https://datasheet.ciiva.com/29568/zxtr2012k-29568981.pdf?src-supplier=Digi-Key; Supplier Part Number 1: ZXTR2012K-13DICT-ND